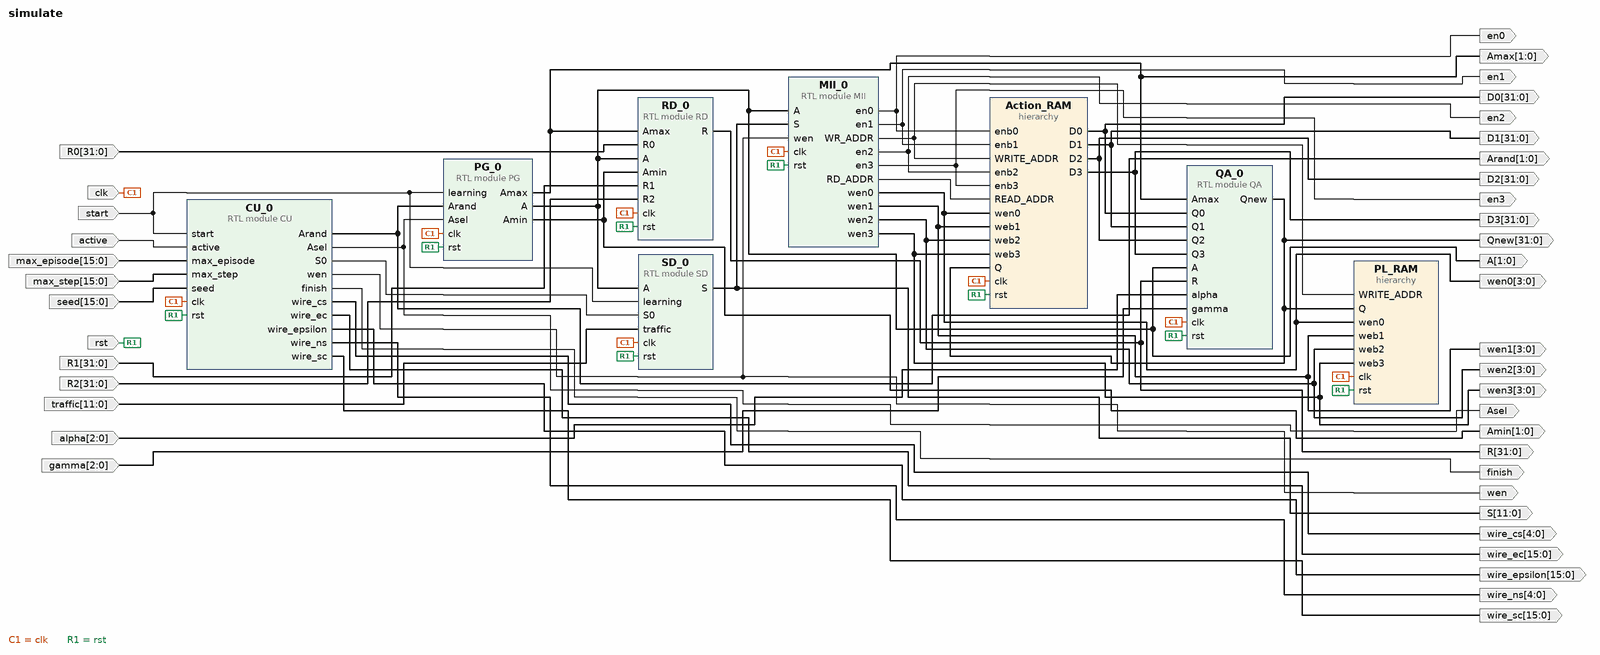
[diagram p0: block diagram of the top level]
# Vivado block design simulate, xc7z020clg400-1, Vivado 2022.1
create_bd_design simulate

create_bd_port -dir O finish
create_bd_port -dir I -type rst rst
set_property -dict {CONFIG.POLARITY ACTIVE_HIGH} [get_bd_ports rst]
create_bd_port -dir I -type clk clk
set_property -dict {CONFIG.CLK_DOMAIN intellight_processing_system7_0_0_FCLK_CLK0 CONFIG.FREQ_HZ 100000000} [get_bd_ports clk]
create_bd_port -dir I start
create_bd_port -dir I -from 15 -to 0 max_step
create_bd_port -dir I -from 15 -to 0 max_episode
create_bd_port -dir I -from 15 -to 0 seed
create_bd_port -dir I -from 2 -to 0 alpha
create_bd_port -dir I -from 2 -to 0 gamma
create_bd_port -dir O -from 31 -to 0 D0
create_bd_port -dir O -from 31 -to 0 D1
create_bd_port -dir O -from 31 -to 0 D2
create_bd_port -dir O -from 31 -to 0 D3
create_bd_port -dir I -from 31 -to 0 R0
create_bd_port -dir I -from 31 -to 0 R1
create_bd_port -dir I -from 31 -to 0 R2
create_bd_port -dir O -from 15 -to 0 wire_sc
create_bd_port -dir O -from 15 -to 0 wire_ec
create_bd_port -dir O -from 4 -to 0 wire_cs
create_bd_port -dir O -from 15 -to 0 wire_epsilon
create_bd_port -dir O -from 4 -to 0 wire_ns
create_bd_port -dir O -from 1 -to 0 A
create_bd_port -dir O -from 31 -to 0 R
create_bd_port -dir O -from 11 -to 0 S
create_bd_port -dir O -from 31 -to 0 Qnew
create_bd_port -dir O -from 1 -to 0 Arand
create_bd_port -dir I -from 11 -to 0 traffic
create_bd_port -dir I active
create_bd_port -dir O wen
create_bd_port -dir O -from 3 -to 0 wen0
create_bd_port -dir O -from 3 -to 0 wen1
create_bd_port -dir O -from 3 -to 0 wen2
create_bd_port -dir O -from 3 -to 0 wen3
create_bd_port -dir O -from 1 -to 0 Amax
create_bd_port -dir O -from 1 -to 0 Amin
create_bd_port -dir O Asel
create_bd_port -dir O en0
create_bd_port -dir O en1
create_bd_port -dir O en2
create_bd_port -dir O en3

create_bd_cell -type hier Action_RAM
create_bd_cell -type hier PL_RAM
create_bd_cell -type module -reference QA QA_0
create_bd_cell -type module -reference RD RD_0
create_bd_cell -type module -reference MII MII_0
create_bd_cell -type module -reference CU CU_0
create_bd_cell -type module -reference SD SD_0
create_bd_cell -type module -reference PG PG_0

# ---- hierarchy /Action_RAM ----
current_bd_instance /Action_RAM
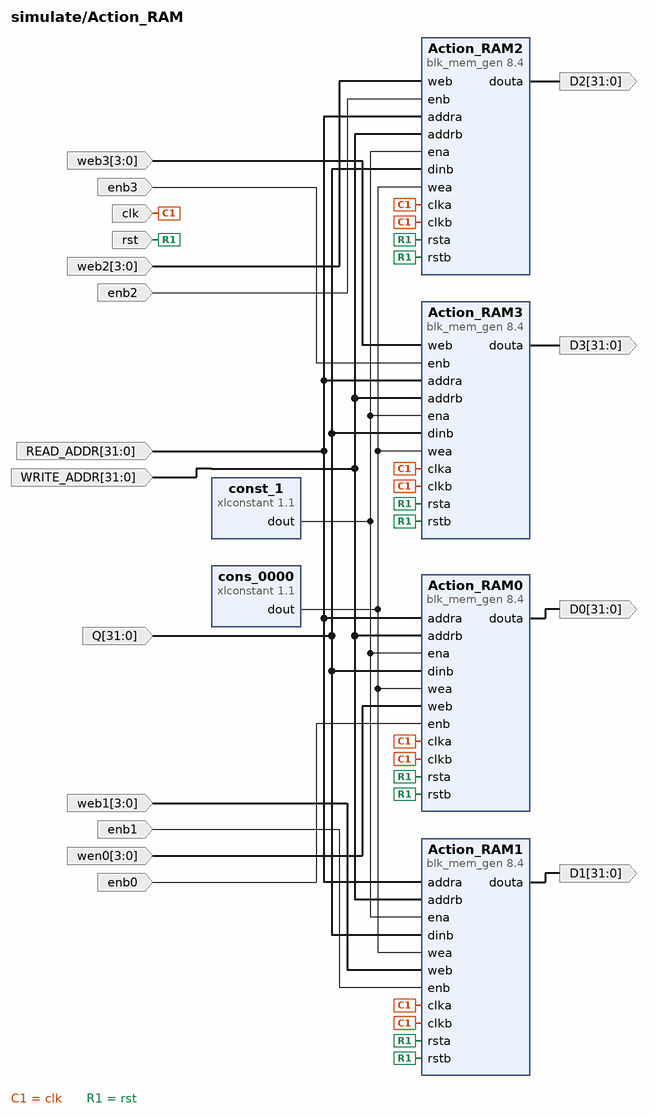
[diagram p1: block diagram inside /Action_RAM]
create_bd_pin -dir I -type clk clk
create_bd_pin -dir I -type rst rst
create_bd_pin -dir I -from 31 -to 0 READ_ADDR
create_bd_pin -dir O -from 31 -to 0 D0
create_bd_pin -dir I -from 3 -to 0 wen0
create_bd_pin -dir I -from 31 -to 0 WRITE_ADDR
create_bd_pin -dir I -from 31 -to 0 Q
create_bd_pin -dir O -from 31 -to 0 D1
create_bd_pin -dir I -from 3 -to 0 web1
create_bd_pin -dir O -from 31 -to 0 D2
create_bd_pin -dir I -from 3 -to 0 web2
create_bd_pin -dir O -from 31 -to 0 D3
create_bd_pin -dir I -from 3 -to 0 web3
create_bd_pin -dir I enb0
create_bd_pin -dir I enb1
create_bd_pin -dir I enb2
create_bd_pin -dir I enb3

create_bd_cell -type ip -vlnv xilinx.com:ip:xlconstant:1.1 const_1
create_bd_cell -type ip -vlnv xilinx.com:ip:xlconstant:1.1 cons_0000
set_property -dict {CONFIG.CONST_VAL 0 CONFIG.CONST_WIDTH 4} [get_bd_cells cons_0000]
create_bd_cell -type ip -vlnv xilinx.com:ip:blk_mem_gen:8.4 Action_RAM0
set_property -dict [list \
  CONFIG.Assume_Synchronous_Clk true \
  CONFIG.EN_SAFETY_CKT true \
  CONFIG.Enable_32bit_Address true \
  CONFIG.Enable_A Use_ENA_Pin \
  CONFIG.Enable_B Use_ENB_Pin \
  CONFIG.Fill_Remaining_Memory_Locations false \
  CONFIG.Load_Init_File false \
  CONFIG.Memory_Type True_Dual_Port_RAM \
  CONFIG.Operating_Mode_A READ_FIRST \
  CONFIG.Operating_Mode_B READ_FIRST \
  CONFIG.Port_B_Clock 100 \
  CONFIG.Port_B_Enable_Rate 100 \
  CONFIG.Port_B_Write_Rate 50 \
  CONFIG.Read_Width_A 32 \
  CONFIG.Read_Width_B 32 \
  CONFIG.Register_PortA_Output_of_Memory_Primitives false \
  CONFIG.Register_PortB_Output_of_Memory_Core false \
  CONFIG.Register_PortB_Output_of_Memory_Primitives false \
  CONFIG.Use_RSTA_Pin true \
  CONFIG.Use_RSTB_Pin true \
  CONFIG.Write_Depth_A 4096 \
  CONFIG.Write_Width_A 32 \
  CONFIG.Write_Width_B 32 \
  CONFIG.use_bram_block Stand_Alone \
] [get_bd_cells Action_RAM0]
create_bd_cell -type ip -vlnv xilinx.com:ip:blk_mem_gen:8.4 Action_RAM1
set_property -dict [list \
  CONFIG.Assume_Synchronous_Clk true \
  CONFIG.EN_SAFETY_CKT true \
  CONFIG.Enable_32bit_Address true \
  CONFIG.Enable_A Use_ENA_Pin \
  CONFIG.Enable_B Use_ENB_Pin \
  CONFIG.Fill_Remaining_Memory_Locations false \
  CONFIG.Load_Init_File false \
  CONFIG.Memory_Type True_Dual_Port_RAM \
  CONFIG.Operating_Mode_A READ_FIRST \
  CONFIG.Operating_Mode_B READ_FIRST \
  CONFIG.Port_B_Clock 100 \
  CONFIG.Port_B_Enable_Rate 100 \
  CONFIG.Port_B_Write_Rate 50 \
  CONFIG.Read_Width_A 32 \
  CONFIG.Read_Width_B 32 \
  CONFIG.Register_PortA_Output_of_Memory_Primitives false \
  CONFIG.Register_PortB_Output_of_Memory_Core false \
  CONFIG.Register_PortB_Output_of_Memory_Primitives false \
  CONFIG.Use_RSTA_Pin true \
  CONFIG.Use_RSTB_Pin true \
  CONFIG.Write_Depth_A 4096 \
  CONFIG.Write_Width_A 32 \
  CONFIG.Write_Width_B 32 \
  CONFIG.use_bram_block Stand_Alone \
] [get_bd_cells Action_RAM1]
create_bd_cell -type ip -vlnv xilinx.com:ip:blk_mem_gen:8.4 Action_RAM2
set_property -dict [list \
  CONFIG.Assume_Synchronous_Clk true \
  CONFIG.EN_SAFETY_CKT true \
  CONFIG.Enable_32bit_Address true \
  CONFIG.Enable_A Use_ENA_Pin \
  CONFIG.Enable_B Use_ENB_Pin \
  CONFIG.Fill_Remaining_Memory_Locations false \
  CONFIG.Load_Init_File false \
  CONFIG.Memory_Type True_Dual_Port_RAM \
  CONFIG.Operating_Mode_A READ_FIRST \
  CONFIG.Operating_Mode_B READ_FIRST \
  CONFIG.Port_B_Clock 100 \
  CONFIG.Port_B_Enable_Rate 100 \
  CONFIG.Port_B_Write_Rate 50 \
  CONFIG.Read_Width_A 32 \
  CONFIG.Read_Width_B 32 \
  CONFIG.Register_PortA_Output_of_Memory_Primitives false \
  CONFIG.Register_PortB_Output_of_Memory_Core false \
  CONFIG.Register_PortB_Output_of_Memory_Primitives false \
  CONFIG.Use_RSTA_Pin true \
  CONFIG.Use_RSTB_Pin true \
  CONFIG.Write_Depth_A 4096 \
  CONFIG.Write_Width_A 32 \
  CONFIG.Write_Width_B 32 \
  CONFIG.use_bram_block Stand_Alone \
] [get_bd_cells Action_RAM2]
create_bd_cell -type ip -vlnv xilinx.com:ip:blk_mem_gen:8.4 Action_RAM3
set_property -dict [list \
  CONFIG.Assume_Synchronous_Clk true \
  CONFIG.EN_SAFETY_CKT true \
  CONFIG.Enable_32bit_Address true \
  CONFIG.Enable_A Use_ENA_Pin \
  CONFIG.Enable_B Use_ENB_Pin \
  CONFIG.Fill_Remaining_Memory_Locations false \
  CONFIG.Load_Init_File false \
  CONFIG.Memory_Type True_Dual_Port_RAM \
  CONFIG.Operating_Mode_A READ_FIRST \
  CONFIG.Operating_Mode_B READ_FIRST \
  CONFIG.Port_B_Clock 100 \
  CONFIG.Port_B_Enable_Rate 100 \
  CONFIG.Port_B_Write_Rate 50 \
  CONFIG.Read_Width_A 32 \
  CONFIG.Read_Width_B 32 \
  CONFIG.Register_PortA_Output_of_Memory_Primitives false \
  CONFIG.Register_PortB_Output_of_Memory_Core false \
  CONFIG.Register_PortB_Output_of_Memory_Primitives false \
  CONFIG.Use_RSTA_Pin true \
  CONFIG.Use_RSTB_Pin true \
  CONFIG.Write_Depth_A 4096 \
  CONFIG.Write_Width_A 32 \
  CONFIG.Write_Width_B 32 \
  CONFIG.use_bram_block Stand_Alone \
] [get_bd_cells Action_RAM3]

# ---- hierarchy /PL_RAM ----
current_bd_instance /PL_RAM
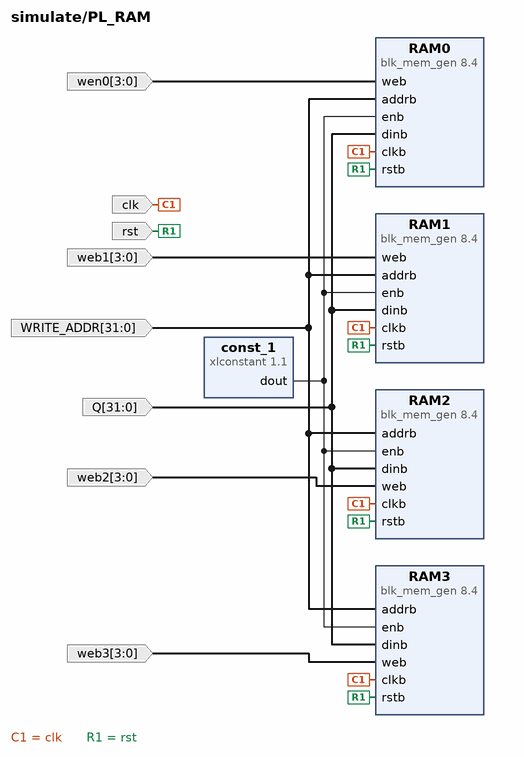
[diagram p2: block diagram inside /PL_RAM]
create_bd_pin -dir I -type clk clk
create_bd_pin -dir I -type rst rst
create_bd_pin -dir I -from 3 -to 0 wen0
create_bd_pin -dir I -from 31 -to 0 WRITE_ADDR
create_bd_pin -dir I -from 31 -to 0 Q
create_bd_pin -dir I -from 3 -to 0 web1
create_bd_pin -dir I -from 3 -to 0 web2
create_bd_pin -dir I -from 3 -to 0 web3

create_bd_cell -type ip -vlnv xilinx.com:ip:xlconstant:1.1 const_1
create_bd_cell -type ip -vlnv xilinx.com:ip:blk_mem_gen:8.4 RAM0
set_property -dict [list \
  CONFIG.Assume_Synchronous_Clk false \
  CONFIG.EN_SAFETY_CKT true \
  CONFIG.Enable_32bit_Address true \
  CONFIG.Enable_B Use_ENB_Pin \
  CONFIG.Memory_Type True_Dual_Port_RAM \
  CONFIG.Operating_Mode_A WRITE_FIRST \
  CONFIG.Operating_Mode_B WRITE_FIRST \
  CONFIG.Port_B_Clock 100 \
  CONFIG.Port_B_Enable_Rate 100 \
  CONFIG.Port_B_Write_Rate 50 \
  CONFIG.Read_Width_A 32 \
  CONFIG.Read_Width_B 32 \
  CONFIG.Register_PortA_Output_of_Memory_Primitives false \
  CONFIG.Register_PortB_Output_of_Memory_Core false \
  CONFIG.Register_PortB_Output_of_Memory_Primitives false \
  CONFIG.Use_RSTA_Pin true \
  CONFIG.Use_RSTB_Pin true \
  CONFIG.Write_Width_A 32 \
  CONFIG.Write_Width_B 32 \
  CONFIG.use_bram_block BRAM_Controller \
] [get_bd_cells RAM0]
create_bd_cell -type ip -vlnv xilinx.com:ip:blk_mem_gen:8.4 RAM1
set_property -dict [list \
  CONFIG.Assume_Synchronous_Clk false \
  CONFIG.EN_SAFETY_CKT true \
  CONFIG.Enable_32bit_Address true \
  CONFIG.Enable_B Use_ENB_Pin \
  CONFIG.Memory_Type True_Dual_Port_RAM \
  CONFIG.Operating_Mode_A WRITE_FIRST \
  CONFIG.Operating_Mode_B WRITE_FIRST \
  CONFIG.Port_B_Clock 100 \
  CONFIG.Port_B_Enable_Rate 100 \
  CONFIG.Port_B_Write_Rate 50 \
  CONFIG.Read_Width_A 32 \
  CONFIG.Read_Width_B 32 \
  CONFIG.Register_PortA_Output_of_Memory_Primitives false \
  CONFIG.Register_PortB_Output_of_Memory_Core false \
  CONFIG.Register_PortB_Output_of_Memory_Primitives false \
  CONFIG.Use_RSTA_Pin true \
  CONFIG.Use_RSTB_Pin true \
  CONFIG.Write_Width_A 32 \
  CONFIG.Write_Width_B 32 \
  CONFIG.use_bram_block BRAM_Controller \
] [get_bd_cells RAM1]
create_bd_cell -type ip -vlnv xilinx.com:ip:blk_mem_gen:8.4 RAM2
set_property -dict [list \
  CONFIG.Assume_Synchronous_Clk false \
  CONFIG.EN_SAFETY_CKT true \
  CONFIG.Enable_32bit_Address true \
  CONFIG.Enable_B Use_ENB_Pin \
  CONFIG.Memory_Type True_Dual_Port_RAM \
  CONFIG.Operating_Mode_A WRITE_FIRST \
  CONFIG.Operating_Mode_B WRITE_FIRST \
  CONFIG.Port_B_Clock 100 \
  CONFIG.Port_B_Enable_Rate 100 \
  CONFIG.Port_B_Write_Rate 50 \
  CONFIG.Read_Width_A 32 \
  CONFIG.Read_Width_B 32 \
  CONFIG.Register_PortA_Output_of_Memory_Primitives false \
  CONFIG.Register_PortB_Output_of_Memory_Core false \
  CONFIG.Register_PortB_Output_of_Memory_Primitives false \
  CONFIG.Use_RSTA_Pin true \
  CONFIG.Use_RSTB_Pin true \
  CONFIG.Write_Width_A 32 \
  CONFIG.Write_Width_B 32 \
  CONFIG.use_bram_block BRAM_Controller \
] [get_bd_cells RAM2]
create_bd_cell -type ip -vlnv xilinx.com:ip:blk_mem_gen:8.4 RAM3
set_property -dict [list \
  CONFIG.Assume_Synchronous_Clk false \
  CONFIG.EN_SAFETY_CKT true \
  CONFIG.Enable_32bit_Address true \
  CONFIG.Enable_B Use_ENB_Pin \
  CONFIG.Memory_Type True_Dual_Port_RAM \
  CONFIG.Operating_Mode_A WRITE_FIRST \
  CONFIG.Operating_Mode_B WRITE_FIRST \
  CONFIG.Port_B_Clock 100 \
  CONFIG.Port_B_Enable_Rate 100 \
  CONFIG.Port_B_Write_Rate 50 \
  CONFIG.Read_Width_A 32 \
  CONFIG.Read_Width_B 32 \
  CONFIG.Register_PortA_Output_of_Memory_Primitives false \
  CONFIG.Register_PortB_Output_of_Memory_Core false \
  CONFIG.Register_PortB_Output_of_Memory_Primitives false \
  CONFIG.Use_RSTA_Pin true \
  CONFIG.Use_RSTB_Pin true \
  CONFIG.Write_Width_A 32 \
  CONFIG.Write_Width_B 32 \
  CONFIG.use_bram_block BRAM_Controller \
] [get_bd_cells RAM3]

# ---- connections ----

current_bd_instance /Action_RAM
connect_bd_net -net MII_0_READ_ADDR [get_bd_pins READ_ADDR] \
  [get_bd_pins Action_RAM0/addra] [get_bd_pins Action_RAM1/addra] [get_bd_pins Action_RAM2/addra] \
  [get_bd_pins Action_RAM3/addra]
connect_bd_net -net MII_0_WRITE_ADDR [get_bd_pins WRITE_ADDR] \
  [get_bd_pins Action_RAM0/addrb] [get_bd_pins Action_RAM1/addrb] [get_bd_pins Action_RAM2/addrb] \
  [get_bd_pins Action_RAM3/addrb]
connect_bd_net -net MII_0_wen0 [get_bd_pins wen0] [get_bd_pins Action_RAM0/web]
connect_bd_net -net MII_0_wen1 [get_bd_pins web1] [get_bd_pins Action_RAM1/web]
connect_bd_net -net MII_0_wen2 [get_bd_pins web2] [get_bd_pins Action_RAM2/web]
connect_bd_net -net MII_0_wen3 [get_bd_pins web3] [get_bd_pins Action_RAM3/web]
connect_bd_net -net RAM1_douta [get_bd_pins Action_RAM1/douta] [get_bd_pins D1]
connect_bd_net -net RAM2_douta [get_bd_pins Action_RAM2/douta] [get_bd_pins D2]
connect_bd_net -net RAM3_douta [get_bd_pins Action_RAM3/douta] [get_bd_pins D3]
connect_bd_net -net blk_mem_gen_0_douta [get_bd_pins Action_RAM0/douta] [get_bd_pins D0]
connect_bd_net -net clka_0_1 [get_bd_pins clk] \
  [get_bd_pins Action_RAM0/clka] [get_bd_pins Action_RAM0/clkb] [get_bd_pins Action_RAM1/clka] [get_bd_pins Action_RAM1/clkb] \
  [get_bd_pins Action_RAM2/clka] [get_bd_pins Action_RAM2/clkb] [get_bd_pins Action_RAM3/clka] [get_bd_pins Action_RAM3/clkb]
connect_bd_net [get_bd_pins const_1/dout] \
  [get_bd_pins Action_RAM0/ena] [get_bd_pins Action_RAM1/ena] [get_bd_pins Action_RAM2/ena] [get_bd_pins Action_RAM3/ena]
connect_bd_net -net dinb_0_1 [get_bd_pins Q] \
  [get_bd_pins Action_RAM0/dinb] [get_bd_pins Action_RAM1/dinb] [get_bd_pins Action_RAM2/dinb] [get_bd_pins Action_RAM3/dinb]
connect_bd_net -net enb1_1 [get_bd_pins enb1] [get_bd_pins Action_RAM1/enb]
connect_bd_net -net enb2_1 [get_bd_pins enb2] [get_bd_pins Action_RAM2/enb]
connect_bd_net -net enb3_1 [get_bd_pins enb3] [get_bd_pins Action_RAM3/enb]
connect_bd_net [get_bd_pins enb0] [get_bd_pins Action_RAM0/enb]
connect_bd_net -net rsta_0_1 [get_bd_pins rst] \
  [get_bd_pins Action_RAM0/rsta] [get_bd_pins Action_RAM0/rstb] [get_bd_pins Action_RAM1/rsta] [get_bd_pins Action_RAM1/rstb] \
  [get_bd_pins Action_RAM2/rsta] [get_bd_pins Action_RAM2/rstb] [get_bd_pins Action_RAM3/rsta] [get_bd_pins Action_RAM3/rstb]
connect_bd_net -net xlconstant_0_dout [get_bd_pins cons_0000/dout] \
  [get_bd_pins Action_RAM0/wea] [get_bd_pins Action_RAM1/wea] [get_bd_pins Action_RAM2/wea] [get_bd_pins Action_RAM3/wea]

current_bd_instance /PL_RAM
connect_bd_net -net MII_0_WRITE_ADDR [get_bd_pins WRITE_ADDR] \
  [get_bd_pins RAM0/addrb] [get_bd_pins RAM1/addrb] [get_bd_pins RAM2/addrb] [get_bd_pins RAM3/addrb]
connect_bd_net -net MII_0_wen0 [get_bd_pins wen0] [get_bd_pins RAM0/web]
connect_bd_net -net MII_0_wen1 [get_bd_pins web1] [get_bd_pins RAM1/web]
connect_bd_net -net MII_0_wen2 [get_bd_pins web2] [get_bd_pins RAM2/web]
connect_bd_net -net MII_0_wen3 [get_bd_pins web3] [get_bd_pins RAM3/web]
connect_bd_net -net clka_0_1 [get_bd_pins clk] [get_bd_pins RAM0/clkb] [get_bd_pins RAM1/clkb] [get_bd_pins RAM2/clkb] [get_bd_pins RAM3/clkb]
connect_bd_net [get_bd_pins const_1/dout] [get_bd_pins RAM0/enb] [get_bd_pins RAM1/enb] [get_bd_pins RAM2/enb] [get_bd_pins RAM3/enb]
connect_bd_net -net dinb_0_1 [get_bd_pins Q] [get_bd_pins RAM0/dinb] [get_bd_pins RAM1/dinb] [get_bd_pins RAM2/dinb] [get_bd_pins RAM3/dinb]
connect_bd_net -net rsta_0_1 [get_bd_pins rst] [get_bd_pins RAM0/rstb] [get_bd_pins RAM1/rstb] [get_bd_pins RAM2/rstb] [get_bd_pins RAM3/rstb]

current_bd_instance /
connect_bd_net [get_bd_pins Action_RAM/D0] [get_bd_ports D0] [get_bd_pins QA_0/Q0]
connect_bd_net [get_bd_pins Action_RAM/D1] [get_bd_ports D1] [get_bd_pins QA_0/Q1]
connect_bd_net [get_bd_pins Action_RAM/D2] [get_bd_ports D2] [get_bd_pins QA_0/Q2]
connect_bd_net [get_bd_pins Action_RAM/D3] [get_bd_ports D3] [get_bd_pins QA_0/Q3]
connect_bd_net [get_bd_pins CU_0/Arand] [get_bd_ports Arand] [get_bd_pins PG_0/Arand]
connect_bd_net [get_bd_pins CU_0/Asel] [get_bd_ports Asel] [get_bd_pins PG_0/Asel]
connect_bd_net [get_bd_pins CU_0/S0] [get_bd_pins SD_0/S0]
connect_bd_net [get_bd_pins CU_0/finish] [get_bd_ports finish]
connect_bd_net [get_bd_pins CU_0/wen] [get_bd_ports wen] [get_bd_pins MII_0/wen]
connect_bd_net [get_bd_pins CU_0/wire_cs] [get_bd_ports wire_cs]
connect_bd_net [get_bd_pins CU_0/wire_ec] [get_bd_ports wire_ec]
connect_bd_net [get_bd_pins CU_0/wire_epsilon] [get_bd_ports wire_epsilon]
connect_bd_net [get_bd_pins CU_0/wire_ns] [get_bd_ports wire_ns]
connect_bd_net [get_bd_pins CU_0/wire_sc] [get_bd_ports wire_sc]
connect_bd_net -net MII_0_READ_ADDR [get_bd_pins MII_0/RD_ADDR] [get_bd_pins Action_RAM/READ_ADDR]
connect_bd_net -net MII_0_WRITE_ADDR [get_bd_pins MII_0/WR_ADDR] [get_bd_pins Action_RAM/WRITE_ADDR] [get_bd_pins PL_RAM/WRITE_ADDR]
connect_bd_net [get_bd_pins MII_0/en0] [get_bd_pins Action_RAM/enb0] [get_bd_ports en0]
connect_bd_net [get_bd_pins MII_0/en1] [get_bd_pins Action_RAM/enb1] [get_bd_ports en1]
connect_bd_net [get_bd_pins MII_0/en2] [get_bd_pins Action_RAM/enb2] [get_bd_ports en2]
connect_bd_net [get_bd_pins MII_0/en3] [get_bd_pins Action_RAM/enb3] [get_bd_ports en3]
connect_bd_net [get_bd_pins MII_0/wen0] [get_bd_pins Action_RAM/wen0] [get_bd_pins PL_RAM/wen0] [get_bd_ports wen0]
connect_bd_net [get_bd_pins MII_0/wen1] [get_bd_pins Action_RAM/web1] [get_bd_pins PL_RAM/web1] [get_bd_ports wen1]
connect_bd_net [get_bd_pins MII_0/wen2] [get_bd_pins Action_RAM/web2] [get_bd_pins PL_RAM/web2] [get_bd_ports wen2]
connect_bd_net [get_bd_pins MII_0/wen3] [get_bd_pins Action_RAM/web3] [get_bd_pins PL_RAM/web3] [get_bd_ports wen3]
connect_bd_net [get_bd_pins PG_0/A] [get_bd_ports A] [get_bd_pins QA_0/A] [get_bd_pins RD_0/A] [get_bd_pins MII_0/A] [get_bd_pins SD_0/A]
connect_bd_net [get_bd_pins PG_0/Amax] [get_bd_ports Amax] [get_bd_pins QA_0/Amax] [get_bd_pins RD_0/Amax]
connect_bd_net [get_bd_pins PG_0/Amin] [get_bd_ports Amin] [get_bd_pins RD_0/Amin]
connect_bd_net [get_bd_pins QA_0/Qnew] [get_bd_pins Action_RAM/Q] [get_bd_pins PL_RAM/Q] [get_bd_ports Qnew]
connect_bd_net -net R0_1 [get_bd_ports R0] [get_bd_pins RD_0/R0]
connect_bd_net -net R1_1 [get_bd_ports R1] [get_bd_pins RD_0/R1]
connect_bd_net -net R2_1 [get_bd_ports R2] [get_bd_pins RD_0/R2]
connect_bd_net [get_bd_pins RD_0/R] [get_bd_ports R] [get_bd_pins QA_0/R]
connect_bd_net [get_bd_pins SD_0/S] [get_bd_ports S] [get_bd_pins MII_0/S]
connect_bd_net [get_bd_ports active] [get_bd_pins CU_0/active]
connect_bd_net [get_bd_ports alpha] [get_bd_pins QA_0/alpha]
connect_bd_net -net clka_0_1 [get_bd_ports clk] \
  [get_bd_pins Action_RAM/clk] [get_bd_pins PL_RAM/clk] [get_bd_pins QA_0/clk] [get_bd_pins RD_0/clk] [get_bd_pins MII_0/clk] \
  [get_bd_pins CU_0/clk] [get_bd_pins SD_0/clk] [get_bd_pins PG_0/clk]
connect_bd_net [get_bd_ports gamma] [get_bd_pins QA_0/gamma]
connect_bd_net [get_bd_ports max_episode] [get_bd_pins CU_0/max_episode]
connect_bd_net [get_bd_ports max_step] [get_bd_pins CU_0/max_step]
connect_bd_net -net rsta_0_1 [get_bd_ports rst] \
  [get_bd_pins Action_RAM/rst] [get_bd_pins PL_RAM/rst] [get_bd_pins QA_0/rst] [get_bd_pins RD_0/rst] [get_bd_pins MII_0/rst] \
  [get_bd_pins CU_0/rst] [get_bd_pins SD_0/rst] [get_bd_pins PG_0/rst]
connect_bd_net -net seed_16bit_1 [get_bd_ports seed] [get_bd_pins CU_0/seed]
connect_bd_net [get_bd_ports start] [get_bd_pins CU_0/start] [get_bd_pins SD_0/learning] [get_bd_pins PG_0/learning]
connect_bd_net -net traffic_0_1 [get_bd_ports traffic] [get_bd_pins SD_0/traffic]

validate_bd_design
save_bd_design
